# Altium schematic sheet Flomio BLE-NFC - Overview.SchDoc: Flomio BLE-NFC::Overview
size Tabloid; Author: Alex J. Tucker; CompanyName: Anidea Engineering, Inc.; DrawnBy: Alex J. Tucker; Engineer: Alex J. Tucker; Organization: Anidea Engineering, Inc.; Address1: 8020 Belvedere Rd.; Address2: Ste #1; Address3: West Palm Beach, FL; Address4: 33411    USA; DocumentNumber: 1; Revision: 3; SheetNumber: 1; SheetTotal: 5
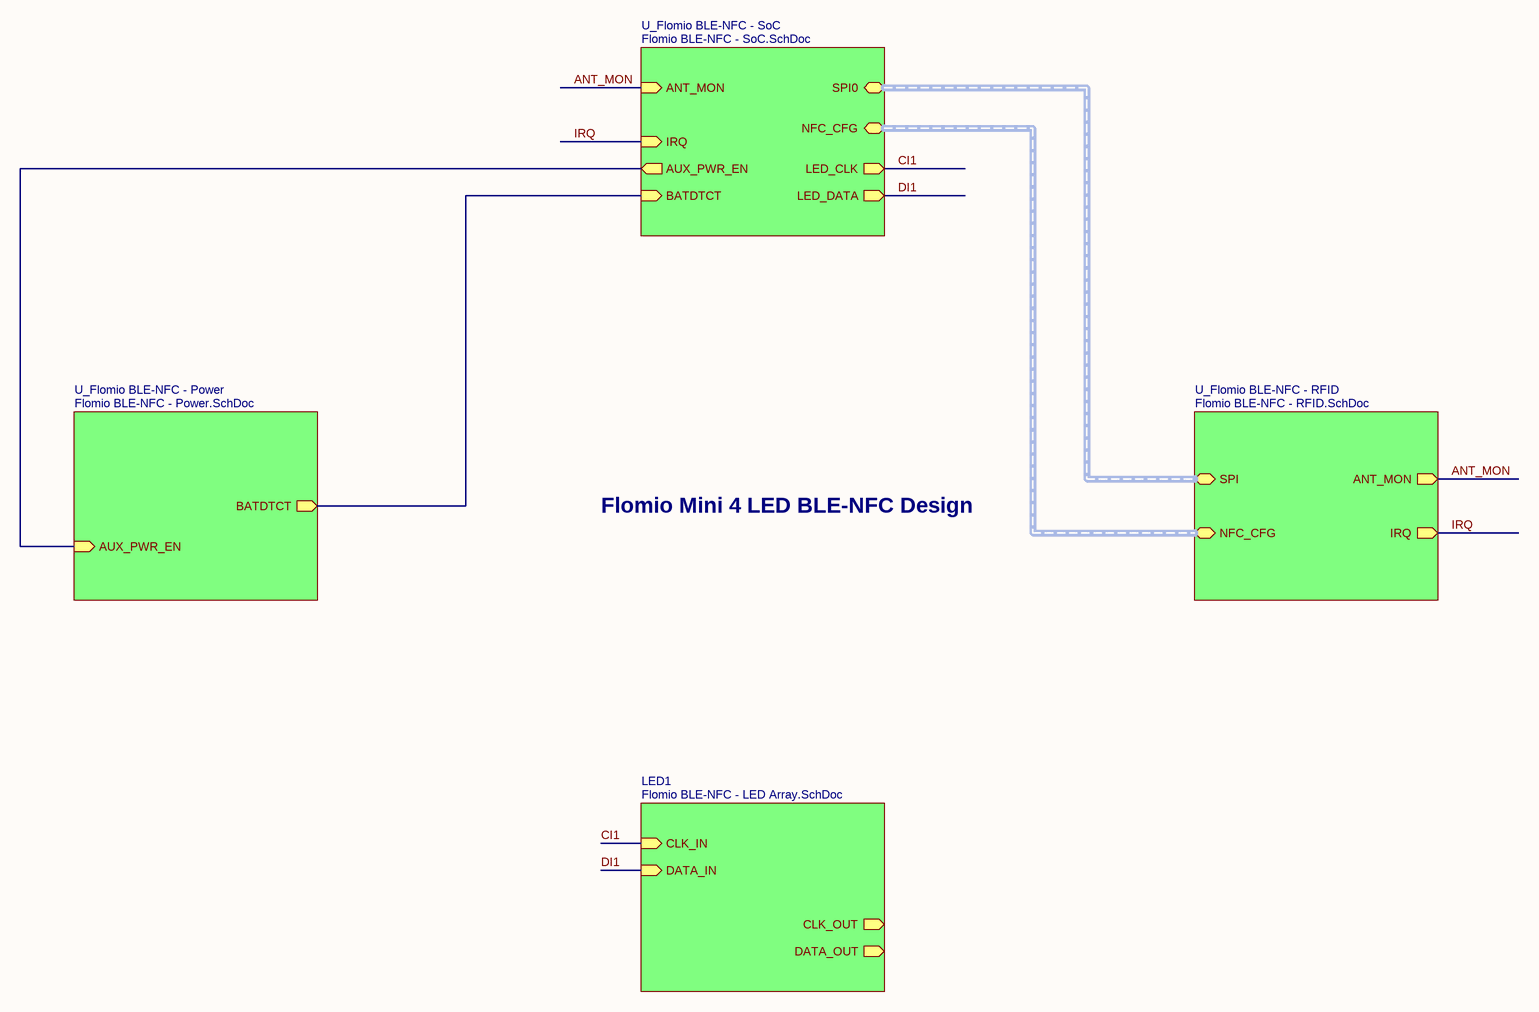
[diagram p0: Flomio BLE-NFC - Overview.SchDoc]

## Sub-sheets
LED1 = Flomio BLE-NFC - LED Array.SchDoc: CLK_OUT (out), CLK_IN (in), DATA_IN (in), DATA_OUT (out)
U_Flomio BLE-NFC - Power = Flomio BLE-NFC - Power.SchDoc: BATDTCT (out), AUX_PWR_EN (in)
U_Flomio BLE-NFC - RFID = Flomio BLE-NFC - RFID.SchDoc: ANT_MON (out), SPI (harness SPI), NFC_CFG (harness NFC), IRQ (out)
U_Flomio BLE-NFC - SoC = Flomio BLE-NFC - SoC.SchDoc: ANT_MON (in), BATDTCT (in), SPI0 (harness SPI), NFC_CFG (harness NFC), LED_CLK (out), LED_DATA (out), IRQ (in), AUX_PWR_EN (out)

## Nets
ANT_MON: sheet U_Flomio BLE-NFC - SoC/ANT_MON, sheet U_Flomio BLE-NFC - RFID/ANT_MON
CI1: sheet LED1/CLK_IN, sheet U_Flomio BLE-NFC - SoC/LED_CLK
DI1: sheet LED1/DATA_IN, sheet U_Flomio BLE-NFC - SoC/LED_DATA
IRQ: sheet U_Flomio BLE-NFC - SoC/IRQ, sheet U_Flomio BLE-NFC - RFID/IRQ
(unnamed): sheet U_Flomio BLE-NFC - SoC/BATDTCT, sheet U_Flomio BLE-NFC - Power/BATDTCT
(unnamed): sheet U_Flomio BLE-NFC - SoC/AUX_PWR_EN, sheet U_Flomio BLE-NFC - Power/AUX_PWR_EN

## Buses and harness runs
harness sheet U_Flomio BLE-NFC - RFID/NFC_CFG = sheet U_Flomio BLE-NFC - SoC/NFC_CFG
harness sheet U_Flomio BLE-NFC - RFID/SPI = sheet U_Flomio BLE-NFC - SoC/SPI0

## Notes on the sheet
- Flomio Mini 4 LED BLE-NFC Design
- Confidential Document
  Unauthorized Use or Release
  Prohibited
- Checked By:
- Designed By:
- Title
- Size:
- Date:
- Tabloid
- Number:
- Time:
- Revision:
- Sheet
- of
- Approved By:
- File: